# Altium schematic sheet Drivers.SchDoc
size A4; Organization: Altium Limited; Address1: L3, 12a Rodborough Rd; Address2: Frenchs Forest; Address3: NSW; Address4: Australia 2086; SheetNumber: 4; SheetTotal: 10
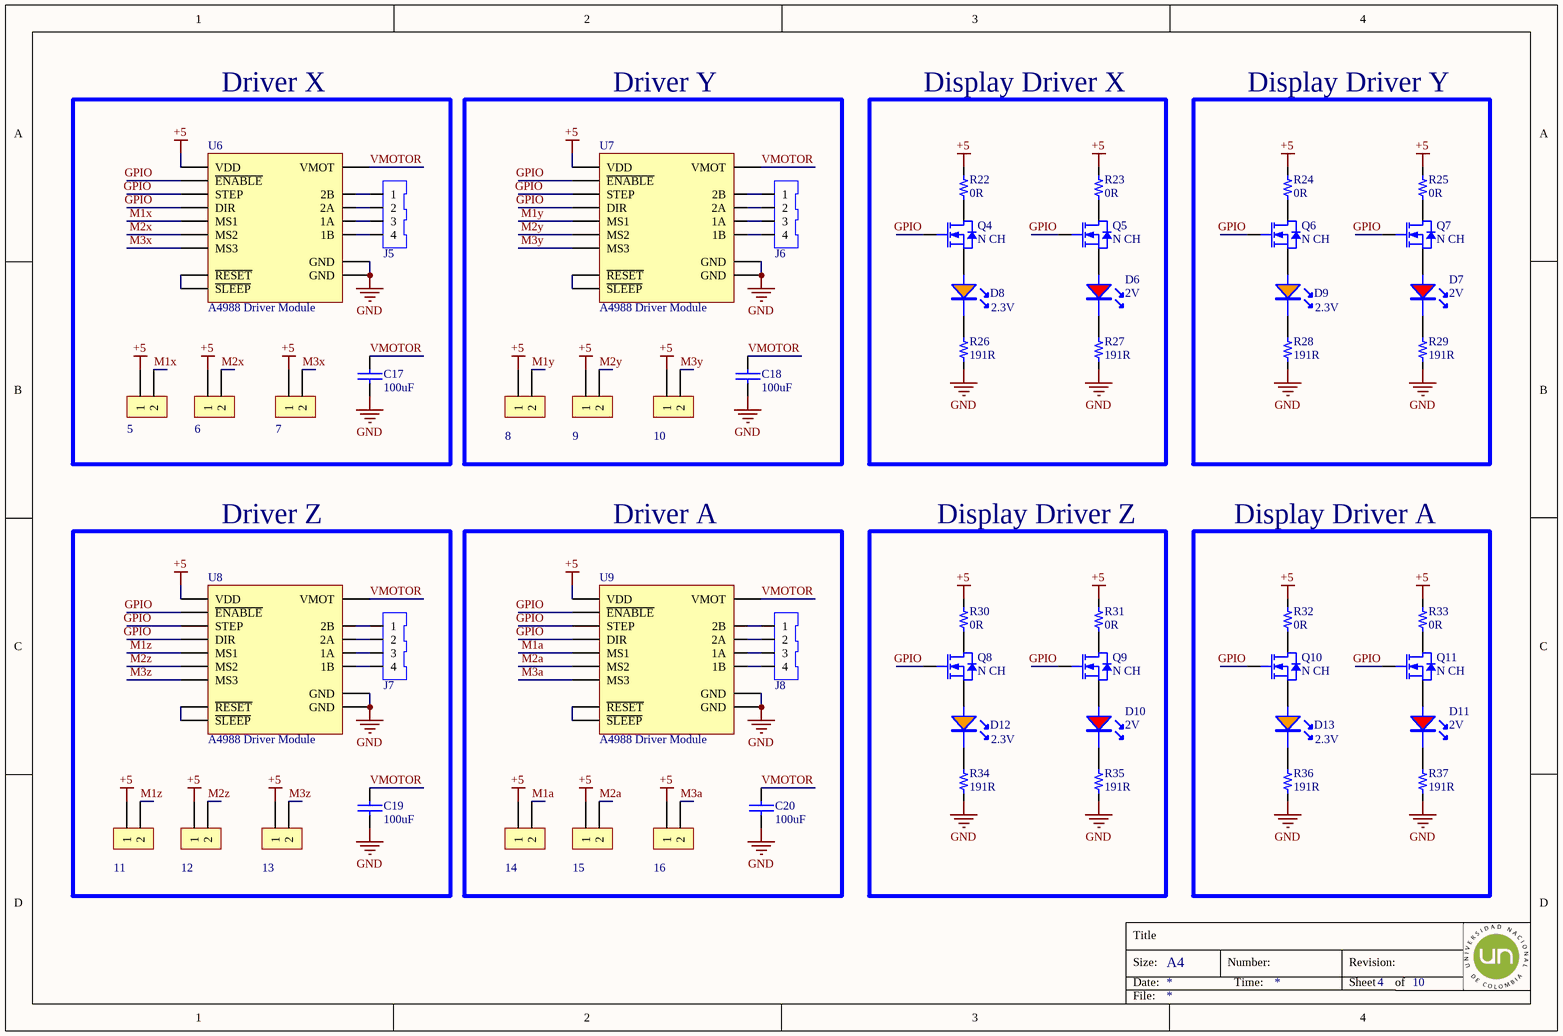
[diagram p0: Drivers.SchDoc]

## Parts
5  2x1  [H_2x1_TH_100mil]  (value not drawn)  (no BOM)
6  2x1  [H_2x1_TH_100mil]  (value not drawn)  (no BOM)
7  2x1  [H_2x1_TH_100mil]  (value not drawn)  (no BOM)
8  2x1  [H_2x1_TH_100mil]  (value not drawn)  (no BOM)
9  2x1  [H_2x1_TH_100mil]  (value not drawn)  (no BOM)
10  2x1  [H_2x1_TH_100mil]  (value not drawn)  (no BOM)
11  2x1  [H_2x1_TH_100mil]  (value not drawn)  (no BOM)
12  2x1  [H_2x1_TH_100mil]  (value not drawn)  (no BOM)
13  2x1  [H_2x1_TH_100mil]  (value not drawn)  (no BOM)
14  2x1  [H_2x1_TH_100mil]  (value not drawn)  (no BOM)
15  2x1  [H_2x1_TH_100mil]  (value not drawn)  (no BOM)
16  2x1  [H_2x1_TH_100mil]  (value not drawn)  (no BOM)
C17  value 100uF  (hidden comment: CAP ALUM 100uF ±20% 35V SMD)
C18  value 100uF  (hidden comment: CAP ALUM 100uF ±20% 35V SMD)
C19  value 100uF  (hidden comment: CAP ALUM 100uF ±20% 35V SMD)
C20  value 100uF  (hidden comment: CAP ALUM 100uF ±20% 35V SMD)
D6  2V  [0805_LED]
D7  2V  [0805_LED]
D8  2.3V  [0805_LED]
D9  2.3V  [0805_LED]
D10  2V  [0805_LED]
D11  2V  [0805_LED]
D12  2.3V  [0805_LED]
D13  2.3V  [0805_LED]
J5  CONN HEADER TH 4POS 2.5mm  (value not drawn)
J6  CONN HEADER TH 4POS 2.5mm  (value not drawn)
J7  CONN HEADER TH 4POS 2.5mm  (value not drawn)
J8  CONN HEADER TH 4POS 2.5mm  (value not drawn)
Q4  N CH  [SOT_23_3]
Q5  N CH  [SOT_23_3]
Q6  N CH  [SOT_23_3]
Q7  N CH  [SOT_23_3]
Q8  N CH  [SOT_23_3]
Q9  N CH  [SOT_23_3]
Q10  N CH  [SOT_23_3]
Q11  N CH  [SOT_23_3]
R22  value 0R  [0603_res]  (hidden comment: 0R 1/10W)
R23  value 0R  [0603_res]  (hidden comment: 0R 1/10W)
R24  value 0R  [0603_res]  (hidden comment: 0R 1/10W)
R25  value 0R  [0603_res]  (hidden comment: 0R 1/10W)
R26  value 191R  [0603_res]  (hidden comment: 191R 1/10W)
R27  value 191R  [0603_res]  (hidden comment: 191R 1/10W)
R28  value 191R  [0603_res]  (hidden comment: 191R 1/10W)
R29  value 191R  [0603_res]  (hidden comment: 191R 1/10W)
R30  value 0R  [0603_res]  (hidden comment: 0R 1/10W)
R31  value 0R  [0603_res]  (hidden comment: 0R 1/10W)
R32  value 0R  [0603_res]  (hidden comment: 0R 1/10W)
R33  value 0R  [0603_res]  (hidden comment: 0R 1/10W)
R34  value 191R  [0603_res]  (hidden comment: 191R 1/10W)
R35  value 191R  [0603_res]  (hidden comment: 191R 1/10W)
R36  value 191R  [0603_res]  (hidden comment: 191R 1/10W)
R37  value 191R  [0603_res]  (hidden comment: 191R 1/10W)
U6  A4988 Driver Module
U7  A4988 Driver Module
U8  A4988 Driver Module
U9  A4988 Driver Module

## Blocks framed on the sheet
Driver X: 5-7 C17 J5 U6
Driver Y: 8-10 C18 J6 U7
Display Driver X: D6 D8 Q4 Q5 R22 R23 R26 R27
Display Driver Y: D7 D9 Q6 Q7 R24 R25 R28 R29
Driver Z: 11-13 C19 J7 U8
Driver A: 14-16 C20 J8 U9
Display Driver Z: D10 D12 Q8 Q9 R30 R31 R34 R35
Display Driver A: D11 D13 Q10 Q11 R32 R33 R36 R37

## Nets
+5: 5.1 6.1 7.1 8.1 9.1 10.1 11.1 12.1 13.1 14.1 15.1 16.1 R22.2 R23.2 R24.2 R25.2 R30.2 R31.2 R32.2 R33.2 U6.15(VDD) U7.15(VDD) U8.15(VDD) U9.15(VDD)
GND: C17.2 C18.2 C19.2 C20.2 R26.1 R27.1 R28.1 R29.1 R34.1 R35.1 R36.1 R37.1 U6.10(GND) U6.16(GND) U7.10(GND) U7.16(GND) U8.10(GND) U8.16(GND) U9.10(GND) U9.16(GND)
GPIO: Q4.1(G) Q5.1(G) Q6.1(G) Q7.1(G) Q8.1(G) Q9.1(G) Q10.1(G) Q11.1(G) U6.1(~{ENABLE}) U6.7(STEP) U6.8(DIR) U7.1(~{ENABLE}) U7.7(STEP) U7.8(DIR) U8.1(~{ENABLE}) U8.7(STEP) U8.8(DIR) U9.1(~{ENABLE}) U9.7(STEP) U9.8(DIR)
M1a: 14.2 U9.2(MS1)
M1x: 5.2 U6.2(MS1)
M1y: 8.2 U7.2(MS1)
M1z: 11.2 U8.2(MS1)
M2a: 15.2 U9.3(MS2)
M2x: 6.2 U6.3(MS2)
M2y: 9.2 U7.3(MS2)
M2z: 12.2 U8.3(MS2)
M3a: 16.2 U9.4(MS3)
M3x: 7.2 U6.4(MS3)
M3y: 10.2 U7.4(MS3)
M3z: 13.2 U8.4(MS3)
VMOTOR: C17.1 C18.1 C19.1 C20.1 U6.9(VMOT) U7.9(VMOT) U8.9(VMOT) U9.9(VMOT)
NetD6_1: D6.1(A) Q5.2(S)
NetD6_2: D6.2 R27.2
NetD7_1: D7.1(A) Q7.2(S)
NetD7_2: D7.2 R29.2
NetD8_1: D8.1(A) Q4.2(S)
NetD8_2: D8.2 R26.2
NetD9_1: D9.1(A) Q6.2(S)
NetD9_2: D9.2 R28.2
NetD10_1: D10.1(A) Q9.2(S)
NetD10_2: D10.2 R35.2
NetD11_1: D11.1(A) Q11.2(S)
NetD11_2: D11.2 R37.2
NetD12_1: D12.1(A) Q8.2(S)
NetD12_2: D12.2 R34.2
NetD13_1: D13.1(A) Q10.2(S)
NetD13_2: D13.2 R36.2
NetJ5_1: J5.1 U6.11(2B)
NetJ5_2: J5.2 U6.12(2A)
NetJ5_3: J5.3 U6.13(1A)
NetJ5_4: J5.4 U6.14(1B)
NetJ6_1: J6.1 U7.11(2B)
NetJ6_2: J6.2 U7.12(2A)
NetJ6_3: J6.3 U7.13(1A)
NetJ6_4: J6.4 U7.14(1B)
NetJ7_1: J7.1 U8.11(2B)
NetJ7_2: J7.2 U8.12(2A)
NetJ7_3: J7.3 U8.13(1A)
NetJ7_4: J7.4 U8.14(1B)
NetJ8_1: J8.1 U9.11(2B)
NetJ8_2: J8.2 U9.12(2A)
NetJ8_3: J8.3 U9.13(1A)
NetJ8_4: J8.4 U9.14(1B)
NetQ4_3: Q4.3(D) R22.1
NetQ5_3: Q5.3(D) R23.1
NetQ6_3: Q6.3(D) R24.1
NetQ7_3: Q7.3(D) R25.1
NetQ8_3: Q8.3(D) R30.1
NetQ9_3: Q9.3(D) R31.1
NetQ10_3: Q10.3(D) R32.1
NetQ11_3: Q11.3(D) R33.1
NetU6_5: U6.5(~{RESET}) U6.6(~{SLEEP})
NetU7_5: U7.5(~{RESET}) U7.6(~{SLEEP})
NetU8_5: U8.5(~{RESET}) U8.6(~{SLEEP})
NetU9_5: U9.5(~{RESET}) U9.6(~{SLEEP})

## Notes on the sheet
- Title
- Size:
- Date:
- A4
- Number:
- Time:
- Revision:
- Sheet
- of
- File:

## Library data of the parts
5-16 = H_Male_2x1_TH_100mil: ComponentLink1Description: LCSC
C17-C20 = Cap_100uF_Electr_SMD _35V: 100uF 35V ±20% 69mA@120Hz SMD,D6.3xL7.7mm Aluminum Electrolytic Capacitors RoHS; Manufacturer: ROQANG; Manufacturer Part Number: RVT1V101M0607; Supplier 1: LCSC; Supplier Part Number 1: C72478; ComponentLink1Description: LCSC; ComponentLink1URL: https://www.lcsc.com/product-detail/C72478.html
D6 D7 D10 D11 = LED_0805_RED: LED RED CLEAR 0805 SMD; Manufacturer: XINGLIGHT; Manufacturer Part Number: XL-2012SURC; Supplier 1: LCSC; Supplier Part Number 1: C965812; ComponentLink1Description: LCSC; ComponentLink1URL: https://www.lcsc.com/product-detail/Light-Emitting-Diodes-LED_XINGLIGHT-XL-2012SURC_C965812.html
D8 D9 D12 D13 = LED_0805_Orange: LED ORANGE WATER CLEAR 0805 SMD; Manufacturer: XINGLIGHT; Manufacturer Part Number: XL-2012UOC; Supplier 1: LCSC; Supplier Part Number 1: C965813; ComponentLink1Description: LCSC; ComponentLink1URL: https://www.lcsc.com/product-detail/C965813.html?s_z=n_XINGLIGHT%2520XL-2012
J5-J8 = Connector JST 4pin: 4P XH 1x4P Tin -25℃~+85℃ White 2.5mm 250V 4 3A 1 Through Hole Through Hole,P=2.5mm Headers, Male Pins RoHS; Manufacturer: JST; Manufacturer Part Number: B4B-XH-A(LF)(SN); Supplier 1: LCSC; Supplier Part Number 1: C144395; ComponentLink1Description: LCSC; ComponentLink1URL: https://www.lcsc.com/product-detail/C144395.html?s_z=n_JST%2520b4b
Q4-Q11 = Q_NFET_50V_200mA_SOT23: MOSFET N-CH 50V 200mA SOT-23; Manufacturer: onsemi; Manufacturer Part Number: BSS138LT1G; Supplier 1: LCSC; Supplier Part Number 1: C82045; ComponentLink1Description: LCSC; ComponentLink1URL: https://www.lcsc.com/product-detail/C82045.html
R22-R25 R30-R33 = Res_0R_0603_1/10W: RES SMD 0R OHM 5% 1/10W 0603; Manufacturer: FOJAN; Manufacturer Part Number: FRC0603P000 TS; ComponentLink1URL: https://www.lcsc.com/product-detail/Chip-Resistor-Surface-Mount_FOJAN-FRC0603P000-TS_C2907080.html; Supplier 1: LCSC; Supplier Part Number 1: C2907080; ComponentLink1Description: LCSC
R26-R29 R34-R37 = Res_191R_0603_1/10W: 100mW Thick Film Resistor 75V ±100ppm/℃ ±1% 191Ω 0603 Chip Resistor - Surface Mount ROHS; Manufacturer: FOJAN; Manufacturer Part Number: FRC0603F1910TS; ComponentLink1URL: https://lcsc.com/product-detail/Chip-Resistor-Surface-Mount_FOJAN-FRC0603F1910TS_C3000718.html; Supplier 1: LCSC; Supplier Part Number 1: C3000718; ComponentLink1Description: LCSC